# Altium schematic sheet PSU_VCC3V3_Buck.SchDoc
size A3; SheetNumber: 11; SheetTotal: 32
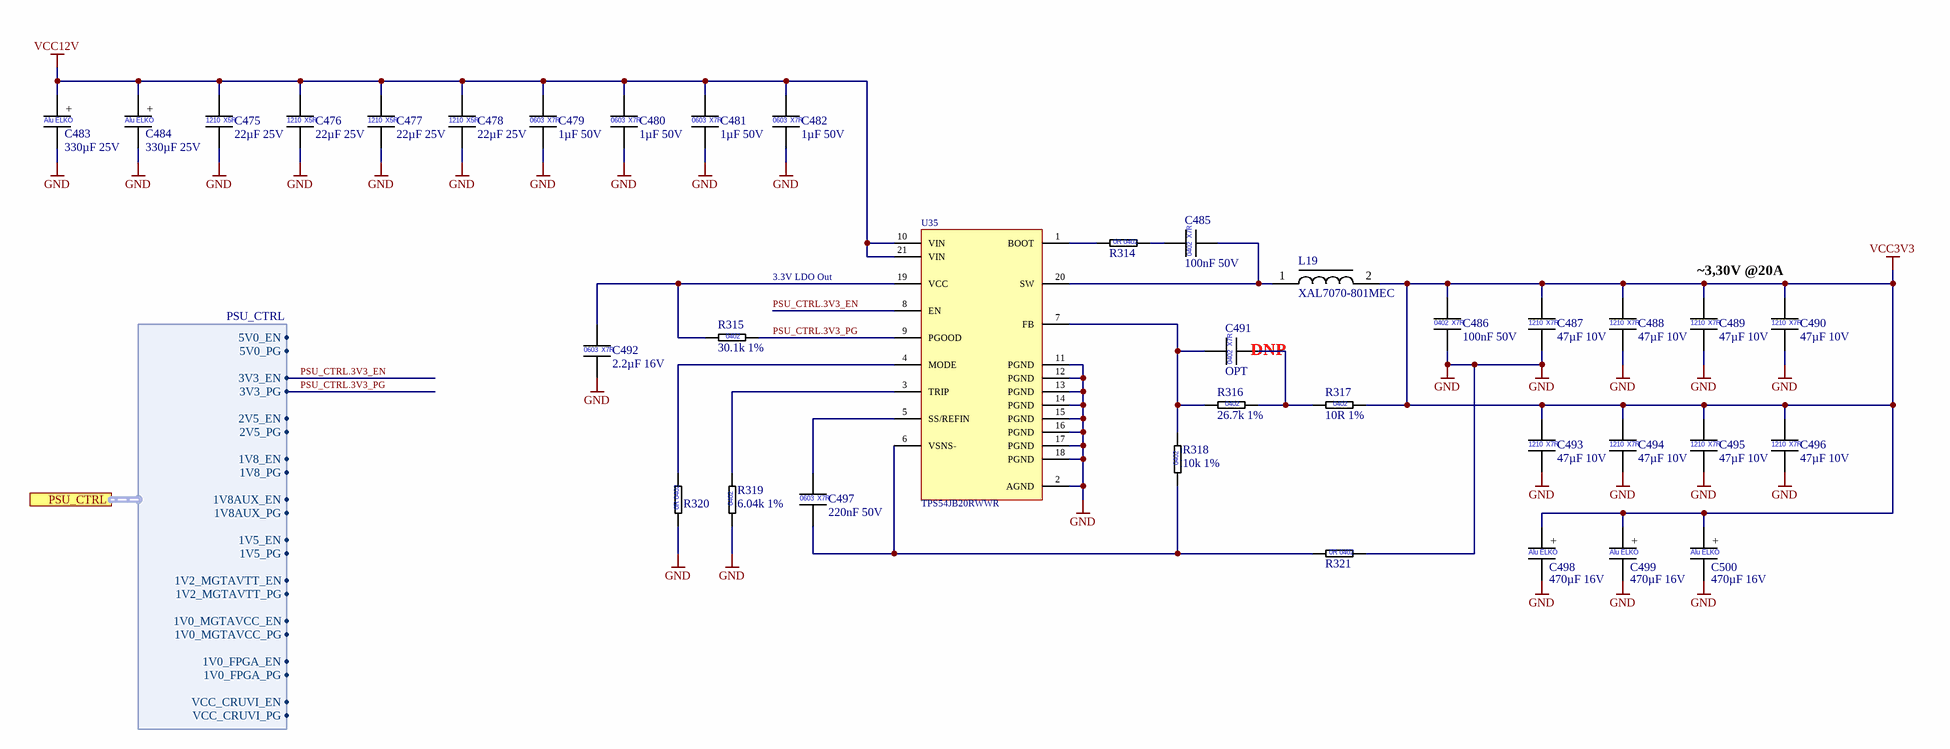
[diagram p0: PSU_VCC3V3_Buck.SchDoc]

## Parts
C475  22µF 25V  [CAP_1210]
C476  22µF 25V  [CAP_1210]
C477  22µF 25V  [CAP_1210]
C478  22µF 25V  [CAP_1210]
C479  1µF 50V  [CAP_0603]
C480  1µF 50V  [CAP_0603]
C481  1µF 50V  [CAP_0603]
C482  1µF 50V  [CAP_0603]
C483  330µF 25V  [WCAP-PTG5_D10H12.5]
C484  330µF 25V  [WCAP-PTG5_D10H12.5]
C485  100nF 50V  [CAP_0402]
C486  100nF 50V  [CAP_0402]
C487  47µF 10V  [CAP_1210]
C488  47µF 10V  [CAP_1210]
C489  47µF 10V  [CAP_1210]
C490  47µF 10V  [CAP_1210]
C491  OPT  [CAP_0402]  (no BOM)
C492  2.2µF 16V  [CAP_0603]
C493  47µF 10V  [CAP_1210]
C494  47µF 10V  [CAP_1210]
C495  47µF 10V  [CAP_1210]
C496  47µF 10V  [CAP_1210]
C497  220nF 50V  [CAP_0603]
C498  470µF 16V  [WCAP-PTG5_D8H13]
C499  470µF 16V  [WCAP-PTG5_D8H13]
C500  470µF 16V  [WCAP-PTG5_D8H13]
L19  XAL7070-801MEC  [COILCRAFT_XAL7070]
R314  0R Jumper  [RES_0402]  (value not drawn)
R315  30.1k 1%  [RES_0402]
R316  26.7k 1%  [RES_0402]
R317  10R 1%  [RES_0402]
R318  10k 1%  [RES_0402]
R319  6.04k 1%  [RES_0402]
R320  0R Jumper  [RES_0402]  (value not drawn)
R321  0R Jumper  [RES_0402]  (value not drawn)
U35  TPS54JB20RWWR  [VQFN-HR21_RWW0021A]

## Ports
PSU_CTRL (harness PSU_CTRL, see Power-Tree[2C], PSU_MGTAVCC_Buck[1B], PSU_MGTAVTT_Buck[1B], PSU_VCC1V0_FPGA_Buck[1B], PSU_VCC1V5_Buck[1B], PSU_VCC1V8_Buck[1B], PSU_VCC1V8AUX_Buck[1B], PSU_VCC2V5_Buck[1B], PSU_VCC5V_Buck[1B], PSU_VCC_CRUVI_ADJ_Buck[1B])

## Harnesses
PSU_CTRL: 5V0_EN, 5V0_PG, 3V3_EN, 3V3_PG, 2V5_EN, 2V5_PG, 1V8_EN, 1V8_PG, 1V8AUX_EN, 1V8AUX_PG, 1V5_EN, 1V5_PG, 1V2_MGTAVTT_EN, 1V2_MGTAVTT_PG, 1V0_MGTAVCC_EN, 1V0_MGTAVCC_PG, 1V0_FPGA_EN, 1V0_FPGA_PG, VCC_CRUVI_EN, VCC_CRUVI_PG

## Nets
GND: C475.2 C476.2 C477.2 C478.2 C479.2 C480.2 C481.2 C482.2 C483.2 C484.2 C486.2 C487.2 C488.2 C489.2 C490.2 C492.2 C493.2 C494.2 C495.2 C496.2 C498.2 C499.2 C500.2 R319.1 R320.1 R321.2 U35.2(AGND) U35.11(PGND) U35.12(PGND) U35.13(PGND) U35.14(PGND) U35.15(PGND) U35.16(PGND) U35.17(PGND) U35.18(PGND)
VCC3V3: C486.1 C487.1 C488.1 C489.1 C490.1 C493.1 C494.1 C495.1 C496.1 C498.1 C499.1 C500.1 L19.2 R317.2
VCC12V: C475.1 C476.1 C477.1 C478.1 C479.1 C480.1 C481.1 C482.1 C483.1 C484.1 U35.10(VIN) U35.21(VIN)
PSU_CTRL.3V3_EN: U35.8(EN) ; port PSU_CTRL.3V3_EN
PSU_CTRL.3V3_PG: R315.2 U35.9(PGOOD) ; port PSU_CTRL.3V3_PG
NetC485_1: C485.1 R314.2
NetC485_2: C485.2 L19.1 U35.20(SW)
NetC491_1: C491.1 R316.1 R318.2 U35.7(FB)
NetC491_2: C491.2 R316.2 R317.1
NetC492_1: C492.1 R315.1 U35.19(VCC)
NetC497_1: C497.1 U35.5(SS/REFIN)
NetC497_2: C497.2 R318.1 R321.1 U35.6(VSNS-)
NetR314_1: R314.1 U35.1(BOOT)
NetR319_2: R319.2 U35.3(TRIP)
NetR320_2: R320.2 U35.4(MODE)

## Notes on the sheet
- 3.3V LDO Out
- (near C490) ~3,30V @20A
- (near C491) DNP
- Company:
- Contact:
- Customer:
- mail@pcb-arts.com
- PCB Arts GmbH
- Title:
- Project:
- The  information  contained  in  these  documents  is  confidential,  privileged  and  only  for  the information of the intended recipient and may not be used, published or redistributed Without the prior written consent from PCB Arts GmbH.
- Engineer:
- Document Number:
- Revision:
- Variant:
- Date:
- Time:
- Sheet:
- Status:
- /
- (in symbol CAP_0402_100nF_50V) X7R; 0402
- (in symbol CAP_0402_OPT) X7R; 0402
- (in symbol CAP_0603_1µF_50V_X7R_10%) 0603; X7R
- (in symbol CAP_0603_2.2µF_16V_X7R_10%) 0603; X7R
- (in symbol CAP_0603_220nF_50V_X7R_10%) 0603; X7R
- (in symbol CAP_1210_22µF_25V) 1210; X5R
- (in symbol CAP_1210_47µF_10V_X7R_10%) 1210; X7R
- (in symbol CAP_D8L9_470µF_16V) +; Alu ELKO
- (in symbol CAP_D10L12.5_330µF_25V) +; Alu ELKO
- (in symbol RES_0402_0R Jumper) 0R 0402
- (in symbol RES_0402_6.04k_1%) 0402
- (in symbol RES_0402_10k_1%) 0402
- (in symbol RES_0402_10R_1%) 0402
- (in symbol RES_0402_26.7k_1%) 0402
- (in symbol RES_0402_30.1k_1%) 0402

## Library data of the parts
C475-C478 = CAP_1210_22µF_25V: Multilayer Ceramic Capacitors MLCC - SMD/SMT 1210 25VDC; Manufacturer 1: KEMET; Manufacturer 1 Prt. Nr.: C1210C226K3PACTU; Manufacturer 2 Prt. Nr.: TMK212BBJ226MG-TT; Manufacturer 2: Taiyo Yuden
C479-C482 = CAP_0603_1µF_50V_X7R_10%: Multilayer Ceramic Capacitors MLCC - SMD/SMT 50V 1uF X7R 0603 10%; Manufacturer 1: KYOCERA AVX; Manufacturer 1 Prt. Nr.: 06035C105KAT2A; Manufacturer 2 Prt. Nr.: MSASU168AB7105KTNA01; Manufacturer 2: TAIYO YUDEN
C483 C484 = CAP_D10L12.5_330µF_25V: Organische Polymer-Aluminiumkondensatoren 330uF 25 Volts 20% AEC-Q200; Manufacturer 1: Würth Elektronik; Manufacturer 1 Prt. Nr.: 870025575009
C485 C486 = CAP_0402_100nF_50V: Multilayer Ceramic Capacitors MLCC - SMD/SMT 0402 50VDC; Manufacturer 1: Murata Electronics; Manufacturer 1 Prt. Nr.: GCM155L8EH104KE07D; Manufacturer 2 Prt. Nr.: UMK105B7104KV-FR; Manufacturer 2: TDK
C487-C490 C493-C496 = CAP_1210_47µF_10V_X7R_10%: Multilayer Ceramic Capacitors MLCC - SMD/SMT 47 uF 10 VDC 10% 1210 X7R; Manufacturer 1: Murata Electronics; Manufacturer 1 Prt. Nr.: GRM32ER71A476KE15L; Manufacturer 2 Prt. Nr.: C1210C106K8RACTU; Manufacturer 2: KEMET
C491 = CAP_0402_OPT: Multilayer Ceramic Capacitors MLCC - SMD/SMT 0402 Optional Placeholder
C492 = CAP_0603_2.2µF_16V_X7R_10%: Multilayer Ceramic Capacitors MLCC - SMD/SMT 2.2 uF 16 VDC 10% 0603 X7R; Manufacturer 1: Murata Electronics; Manufacturer 1 Prt. Nr.: GRM188Z71C225KE43D; Manufacturer 2 Prt. Nr.: EMK107BB7225KA-T; Manufacturer 2: TAIYO YUDEN
C497 = CAP_0603_220nF_50V_X7R_10%: Multilayer Ceramic Capacitors MLCC - SMD/SMT 0.22 uF 50 VDC 10% 0603 X7R; Manufacturer 1: Murata Electronics; Manufacturer 1 Prt. Nr.: GRJ188R71H224KE11D; Manufacturer 2 Prt. Nr.: CGA3E3X7R1H224K080AE; Manufacturer 2: TDK
C498-C500 = CAP_D8L9_470µF_16V: Organische Polymer-Aluminiumkondensatoren 470uF 16 Volts 20%; Manufacturer 1: Würth Elektronik; Manufacturer 1 Prt. Nr.: 870025374007
L19 = XAL7070-801MEC_Power Inductors SMD 800nH Shld 20% 25.8A 2.29mOhms AECQ200: Power Inductors - SMD 800nH Shld 20% 25.8A 2.29mOhms AECQ200; Manufacturer 1: Coilcraft; Manufacturer 1 Prt. Nr.: XAL7070-801MEC
R314 R320 R321 = RES_0402_0R Jumper: Thick Film Resistors - SMD 0Ohm; Manufacturer 1: Vishay / Dale; Manufacturer 1 Prt. Nr.: CRCW04020000Z0EDC; Manufacturer 2 Prt. Nr.: RC0402JR-070RL; Manufacturer 2: Yageo
R315 = RES_0402_30.1k_1%: Thick Film Resistors - SMD 30.1kOhm 1%; Manufacturer 1: Vishay / Dale; Manufacturer 1 Prt. Nr.: CRCW040230K1FKEDC; Manufacturer 2 Prt. Nr.: RC0402FR-1330K1L; Manufacturer 2: Yageo
R316 = RES_0402_26.7k_1%: Thick Film Resistors - SMD 26.7kOhm 1%; Manufacturer 1: Vishay / Dale; Manufacturer 1 Prt. Nr.: CRCW040226K7FKEDC; Manufacturer 2 Prt. Nr.: RC0402FR-0726K7L; Manufacturer 2: Yageo
R317 = RES_0402_10R_1%: Thick Film Resistors - SMD 10Ohm 1%; Manufacturer 1: Vishay / Dale; Manufacturer 1 Prt. Nr.: CRCW040210R0FKEE; Manufacturer 2 Prt. Nr.: RC0402FR-7W10RL; Manufacturer 2: Yageo
R318 = RES_0402_10k_1%: Thick Film Resistors - SMD 10kOhm 1%; Manufacturer 1: Vishay / Dale; Manufacturer 1 Prt. Nr.: CRCW040210K0FKEDC; Manufacturer 2 Prt. Nr.: RC0402FR-7W10KL; Manufacturer 2: Yageo
R319 = RES_0402_6.04k_1%: Thick Film Resistors - SMD 6.04kOhm 1%; Manufacturer 1: Vishay / Dale; Manufacturer 1 Prt. Nr.: CRCW04026K04FKEDC; Manufacturer 2 Prt. Nr.: RC0402FR-7W6K04L; Manufacturer 2: Yageo
U35 = TPS54JB20RWWR_Switching Voltage Regulators 2.7-V to 16-V input 20-A synchronous Buck: Switching Voltage Regulators 2.7-V to 16-V input 20-A synchronous Buck; Manufacturer 1: Texas Instruments; Manufacturer 1 Prt. Nr.: TPS54JB20RWWR